# Altium schematic sheet schematicembedded.SchDoc
size 431 x 482 mm; SheetNumber: 1; SheetTotal: 1; ENG_APP_DATE: --/--/--; DSN_APP_DATE: --/--/--; CHK_APP_DATE: --/--/--
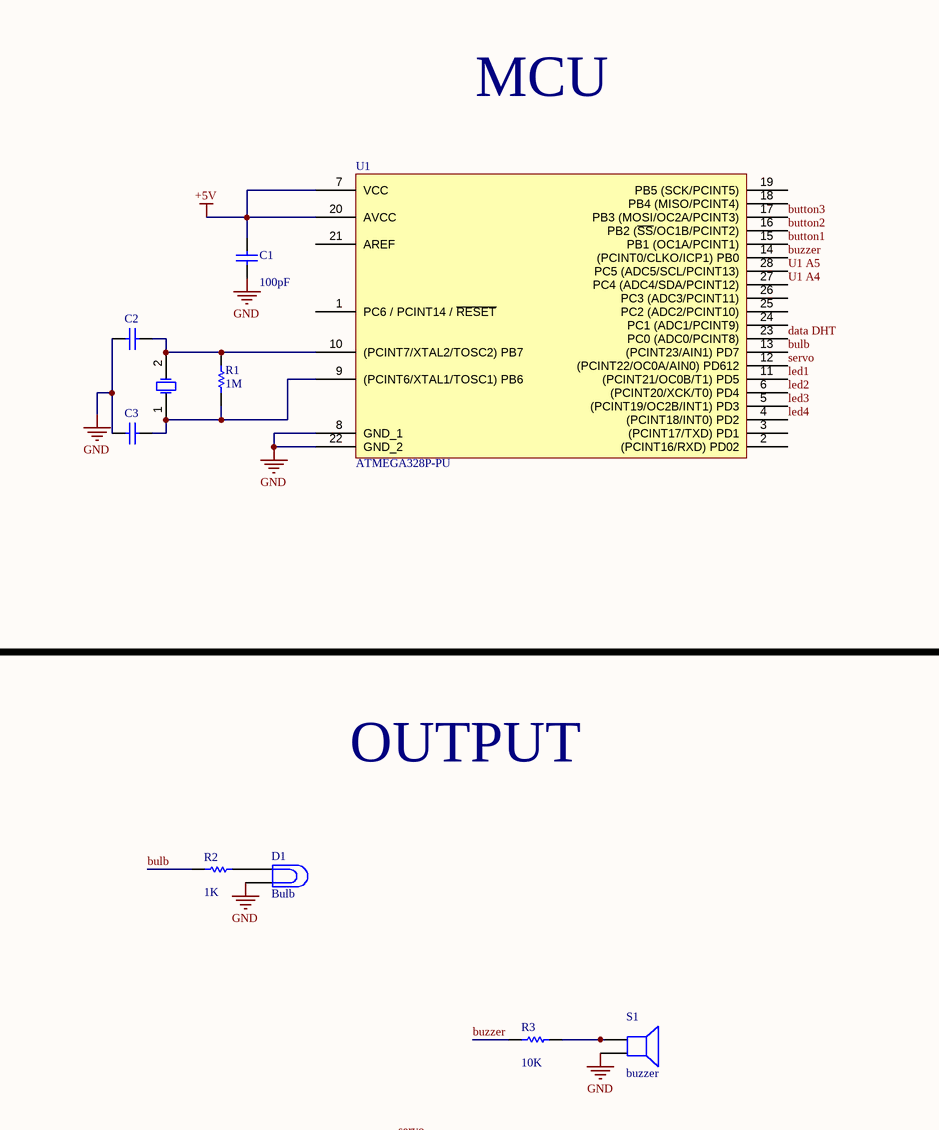
[diagram p0: schematicembedded.SchDoc, top left]
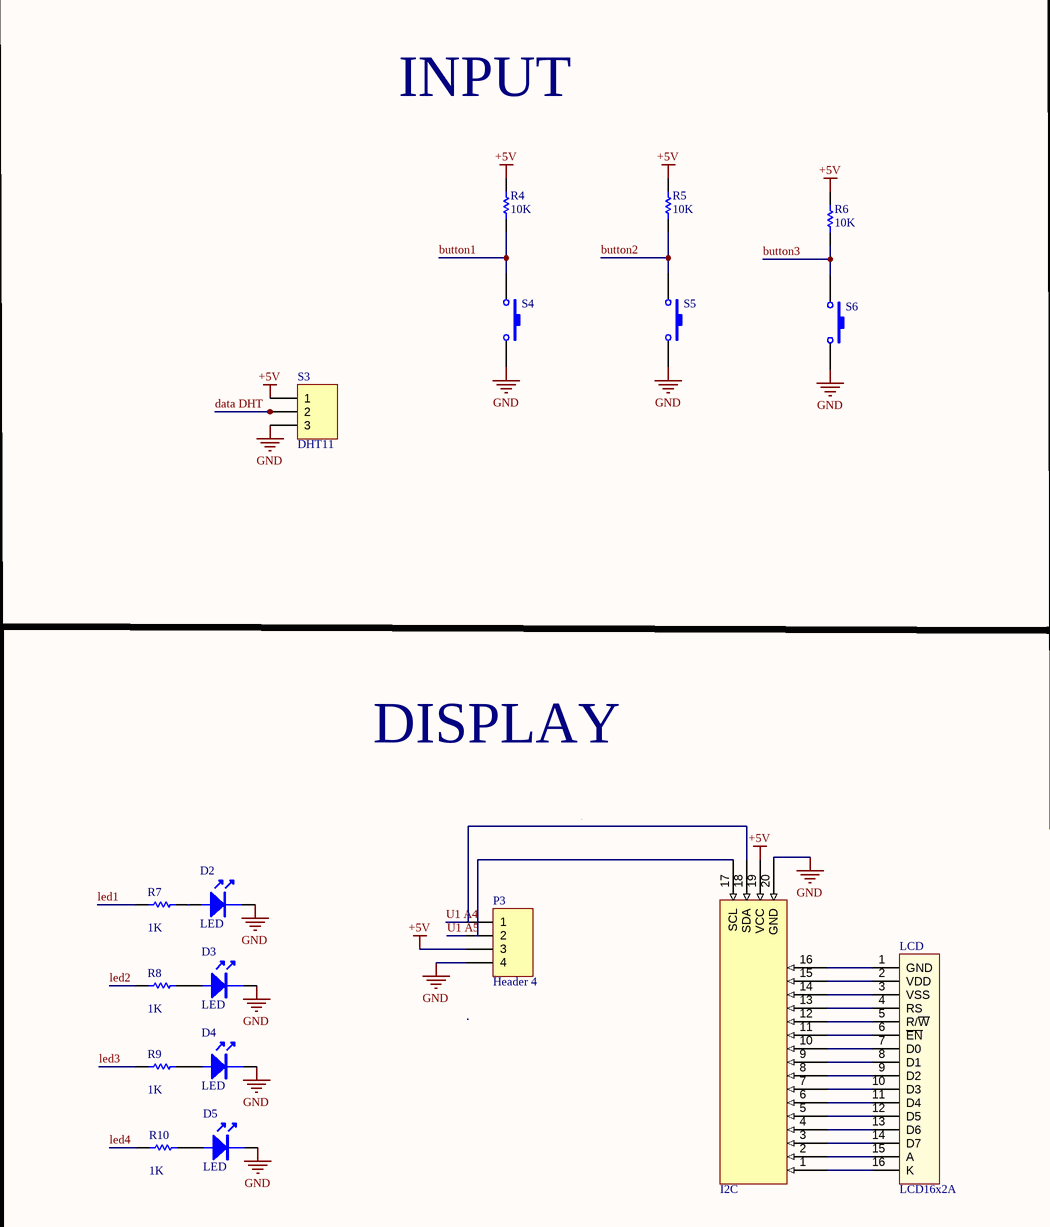
[diagram p1: schematicembedded.SchDoc, top right]
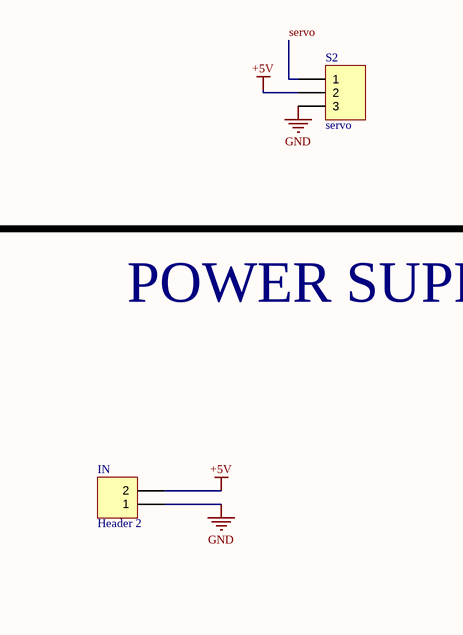
[diagram p2: schematicembedded.SchDoc, bottom left]

## Parts
C1  value 100pF  [RAD-0.3]  (hidden comment: Cap)
C2  Cap  [RAD-0.3]  (value not drawn)
C3  Cap  [RAD-0.3]  (value not drawn)
D1  Bulb  [PIN2]
D2  LED  [CAP10UF]
D3  LED  [CAP10UF]
D4  LED  [CAP10UF]
D5  LED  [CAP10UF]
I2C  Component_1  (value not drawn)
IN  Header 2  [HDR1X2]
LCD  LCD16x2A  [LCD16X2]
P3  Header 4  [HDR1X4]
R1  value 1M  [AXIAL-0.3]  (hidden comment: Res1)
R2  value 1K  [AXIAL-0.3]  (hidden comment: Res1)
R3  value 10K  [AXIAL-0.3]  (hidden comment: Res1)
R4  value 10K  [AXIAL-0.3]  (hidden comment: Res1)
R5  value 10K  [AXIAL-0.3]  (hidden comment: Res1)
R6  value 10K  [AXIAL-0.3]  (hidden comment: Res1)
R7  value 1K  [AXIAL-0.3]  (hidden comment: Res1)
R8  value 1K  [AXIAL-0.3]  (hidden comment: Res1)
R9  value 1K  [AXIAL-0.3]  (hidden comment: Res1)
R10  value 1K  [AXIAL-0.3]  (hidden comment: Res1)
S1  buzzer  [PIN2]
S2  servo  [HDR1X3]
S3  DHT11  [HDR1X3]
S4  SW-PB  [SPST-2]  (value not drawn)
S5  SW-PB  [SPST-2]  (value not drawn)
S6  SW-PB  [SPST-2]  (value not drawn)
U1  ATMEGA328P-PU  [27_DIP_7.62mm]
Y1  XTAL  [R38]  (value not drawn)

## Nets
+5V: C1.2 I2C.19(VCC) IN.2 P3.3 R4.2 R5.2 R6.2 S2.2 S3.1 U1.7(VCC) U1.20(AVCC)
GND: C1.1 C2.2 C3.2 D1.2 D2.2 D3.2 D4.2 D5.2 I2C.20(GND) IN.1 P3.4 S1.2 S2.3 S3.3 S4.2 S5.2 S6.2 U1.8(GND_1) U1.22(GND_2)
bulb: R2.1 U1.13((PCINT23/AIN1)_PD7)
button1: R4.1 S4.1 U1.15(PB1_(OC1A/PCINT1))
button2: R5.1 S5.1 U1.16(PB2_(~{SS}/OC1B/PCINT2))
button3: R6.1 S6.1 U1.17(PB3_(MOSI/OC2A/PCINT3))
buzzer: R3.1 U1.14((PCINT0/CLKO/ICP1)_PB0)
data DHT: S3.2 U1.23(PC0_(ADC0/PCINT8))
led1: R7.1 U1.11((PCINT21/OC0B/T1)_PD5)
led2: R8.1 U1.6((PCINT20/XCK/T0)_PD4)
led3: R9.1 U1.5((PCINT19/OC2B/INT1)_PD3)
led4: R10.1 U1.4((PCINT18/INT0)_PD2)
servo: S2.1 U1.12((PCINT22/OC0A/AIN0)_PD612)
U1 A4: P3.1 U1.27(PC4_(ADC4/SDA/PCINT12))
U1 A5: P3.2 U1.28(PC5_(ADC5/SCL/PCINT13))
NetC2_1: C2.1 R1.2 U1.10((PCINT7/XTAL2/TOSC2)_PB7) Y1.2(OSC2)
NetC3_1: C3.1 R1.1 U1.9((PCINT6/XTAL1/TOSC1)_PB6) Y1.1(OSC1)
NetD1_1: D1.1 R2.2
NetD2_1: D2.1 R7.2
NetD3_1: D3.1 R8.2
NetD4_1: D4.1 R9.2
NetD5_1: D5.1 R10.2
NetI2C_1: I2C.1 LCD.16(K)
NetI2C_2: I2C.2 LCD.15(A)
NetI2C_3: I2C.3 LCD.14(D7)
NetI2C_4: I2C.4 LCD.13(D6)
NetI2C_5: I2C.5 LCD.12(D5)
NetI2C_6: I2C.6 LCD.11(D4)
NetI2C_7: I2C.7 LCD.10(D3)
NetI2C_8: I2C.8 LCD.9(D2)
NetI2C_9: I2C.9 LCD.8(D1)
NetI2C_10: I2C.10 LCD.7(D0)
NetI2C_11: I2C.11 LCD.6(~{EN})
NetI2C_12: I2C.12 LCD.5(R/~{W})
NetI2C_13: I2C.13 LCD.4(RS)
NetI2C_14: I2C.14 LCD.3(VSS)
NetI2C_15: I2C.15 LCD.2(VDD)
NetI2C_16: I2C.16 LCD.1(GND)
NetR3_2: R3.2 S1.1

Not connected (* = marked no-connect by the designer): I2C 17(SCL) 18(SDA); U1 1(PC6_/_PCINT14_/_~{RESET}) 2((PCINT16/RXD)_PD02) 3((PCINT17/TXD)_PD1) 18(PB4_(MISO/PCINT4)) 19(PB5_(SCK/PCINT5)) 21(AREF) 24(PC1_(ADC1/PCINT9)) 25(PC2_(ADC2/PCINT10)) 26(PC3_(ADC3/PCINT11))

## Notes on the sheet
- MCU
- INPUT
- OUTPUT
- DISPLAY
- POWER SUPPLY
- Title:
- temperature controller
- Desc:
- Designed by:
- Truong Son
- Document NO:
- 0001
- Revision:
- 2.2.1
- Checked by:
- Approved by:
- Bao Nguyen
- Truong Doanh
- Sheet:
- Date:
- 29/10/2024
- 1 of 1
- Size:
- Orcad C

## Library data of the parts
C1 = Cap: Capacitor; Published: 8-Jun-2000; LatestRevisionDate: 17-Jul-2002; LatestRevisionNote: Re-released for DXP Platform.; PackageReference: RAD-0.3; Publisher: Altium Limited; PackageDescription: Radial Cap, Thru-Hole; 2 Leads; 0.3 in Pin Spacing
C2 C3 = Cap: Capacitor; Value: 100pF; Published: 8-Jun-2000; LatestRevisionDate: 17-Jul-2002; LatestRevisionNote: Re-released for DXP Platform.; PackageReference: RAD-0.3; Publisher: Altium Limited; PackageDescription: Radial Cap, Thru-Hole; 2 Leads; 0.3 in Pin Spacing
D1 = Lamp: Incandescent Bulb; Published: 24-Mar-1999; LatestRevisionDate: 17-Jul-2002; LatestRevisionNote: Re-released for DXP Platform.; PackageReference: PIN2; Publisher: Altium Limited
IN = Header 2: Header, 2-Pin; LatestRevisionDate: 17-Jul-2002; LatestRevisionNote: Re-released for DXP Platform.; Publisher: Altium Limited
LCD = LCD16x2: LCD dipslay 16 char, 2 line; Value: LCD16x2A
P3 = Header 4: Header, 4-Pin; LatestRevisionDate: 17-Jul-2002; LatestRevisionNote: Re-released for DXP Platform.; Publisher: Altium Limited
R1-R10 = Res1: Resistor; Published: 8-Jun-2000; LatestRevisionDate: 17-Jul-2002; LatestRevisionNote: Re-released for DXP Platform.; PackageReference: AXIAL-0.3; Publisher: Altium Limited; PackageDescription: Axial Device, Thru-Hole; 2 Leads; 0.3 in Pin Spacing
S1 = Speaker: Loudspeaker; Published: 24-Mar-1999; LatestRevisionDate: 17-Jul-2002; LatestRevisionNote: Re-released for DXP Platform.; PackageReference: PIN2; Publisher: Altium Limited
S2 S3 = Header 3: Header, 3-Pin; LatestRevisionDate: 17-Jul-2002; LatestRevisionNote: Re-released for DXP Platform.; Publisher: Altium Limited
S4-S6 = SW-PB: Switch; Published: 24-Mar-1999; LatestRevisionDate: 17-Jul-2002; LatestRevisionNote: Re-released for DXP Platform.; PackageReference: SPST-2; Publisher: Altium Limited; PackageDescription: Switch; 2 Leads
U1 = ATMEGA328P-PU: ATMEGA328P-PU; 8 bit Microcontroller AVR 20MHz 1; 32kb Flash; 2kb RAM; I2C SPI 2; Manufacturer: Microchip / Atmel; Number of PWM Channels: 6; Number of Timers/Counters: 3; Min Supply Voltage: 1.8V; Max Supply Voltage: 5.5V; Interface: I2C,SPI,UART,USART,2-Wire; Number of I/Os: 23; Oscillator Type: Internal; Data Bus Width: 8b; Number of SPI Channels: 1; Watchdog Timer: Yes; Peripherals: Brown-out Detect/Reset,POR,PWM,WDT; Manufacturer Part Number: ATMEGA328P-PU; RoHS: Yes; Category: Microcontrollers; Stock 1: 5280; Pricing 1: 1=2,08000, 25=1,91000, 100=1,73000 (USD); Mount: Through Hole; Case/Package: PDIP; Number of Pins: 28; Contact Plating: Tin,Matte; Min Operating Temperature: -40°C; Max Operating Temperature: 85°C; Package Quantity: 14; Core Architecture: AVR; RAM Size: 2KB; Number of ADC Channels: 6; Packaging: Rail/Tube; Frequency: 20MHz; Number of Programmable I/O: 23; Max Frequency: 20MHz; Number of I2C Channels: 1; Memory Type: FLASH; Memory Size: 32KB; Length: 37.4mm; Height: 3.28mm; Width: 6.76mm; Radiation Hardening: No; REACH SVHC: No SVHC; Lead Free: Lead Free; ComponentLink1URL: https://datasheet.ciiva.com/20168/73-4283-20168380.pdf?src-supplier=Rapid+Electronics; ComponentLink1Description: https://datasheet.ciiva.com/20168/73-4283-20168380.pdf?src-supplier=Rapid+Electronics; ComponentLink2URL: https://datasheet.ciiva.com/19457/2139111-19457070.pdf?src-supplier=Jameco; ComponentLink2Description: https://datasheet.ciiva.com/19457/2139111-19457070.pdf?src-supplier=Jameco; ComponentLink3URL: https://datasheet.ciiva.com/1157/1684409-1157696.pdf?src-supplier=Element14; ComponentLink3Description: https://datasheet.ciiva.com/1157/1684409-1157696.pdf?src-supplier=Element14; ComponentLink4URL: https://datasheet.ciiva.com/26818/atmega328p-pu-26818578.pdf?src-supplier=IIIC; ComponentLink4Description: https://datasheet.ciiva.com/26818/atmega328p-pu-26818578.pdf?src-supplier=IIIC; ComponentLink5URL: https://datasheet.ciiva.com/29119/155197-da-01-en-microcontr-atmega328p-pu-8bit-pdip-28-29119593.pdf?src-supplier=Conrad; ComponentLink5Description: https://datasheet.ciiva.com/29119/155197-da-01-en-microcontr-atmega328p-pu-8bit-pdip-28-29119593.pdf?src-supplier=Conrad; ComponentLink6URL: https://datasheet.ciiva.com/15213/getdatasheetpartid-318533-15213133.pdf?src-supplier=Verical; ComponentLink6Description: https://datasheet.ciiva.com/15213/getdatasheetpartid-318533-15213133.pdf?src-supplier=Verical; Supplier 1: Digi-Key; Supplier Part Number 1: ATMEGA328P-PU-ND
Y1 = XTAL: Crystal Oscillator; Published: 8-Jun-2000; LatestRevisionDate: 17-Jul-2002; LatestRevisionNote: Re-released for DXP Platform.; PackageReference: R38; Publisher: Altium Limited; PackageDescription: Crystal, Thru-Hole; 2 Leads; Body 3.1 x 8.2 mm (Dia.xH)